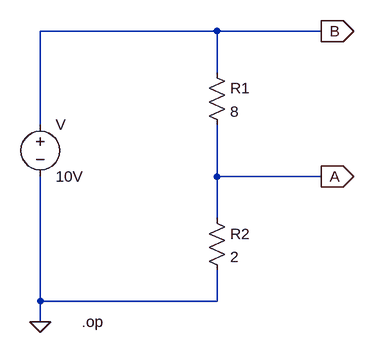
[diagram p0: schematic voltage_divider_1.asc]
voltage_divider_1.asc, the LTspice schematic file:
Version 4
SHEET 1 880 680
WIRE 416 144 144 144
WIRE 576 144 416 144
WIRE 416 208 416 144
WIRE 144 288 144 144
WIRE 416 368 416 288
WIRE 576 368 416 368
WIRE 416 432 416 368
WIRE 144 560 144 368
WIRE 416 560 416 512
WIRE 416 560 144 560
WIRE 144 592 144 560
FLAG 144 592 0
FLAG 576 368 A
IOPIN 576 368 Out
FLAG 576 144 B
IOPIN 576 144 Out
SYMBOL voltage 144 272 R0
SYMATTR InstName V
SYMATTR Value 10V
SYMBOL Res 400 192 R0
SYMATTR InstName R1
SYMATTR Value 8
SYMBOL Res 400 416 R0
SYMATTR InstName R2
SYMATTR Value 2
TEXT 208 592 Left 2 !.op

The netlist it stands for:
* voltage_divider_1.asc
V B 0 10V
R1 B A 8
R2 A 0 2
.op
.backanno
.end